# Altium project sudoku.PrjPcb
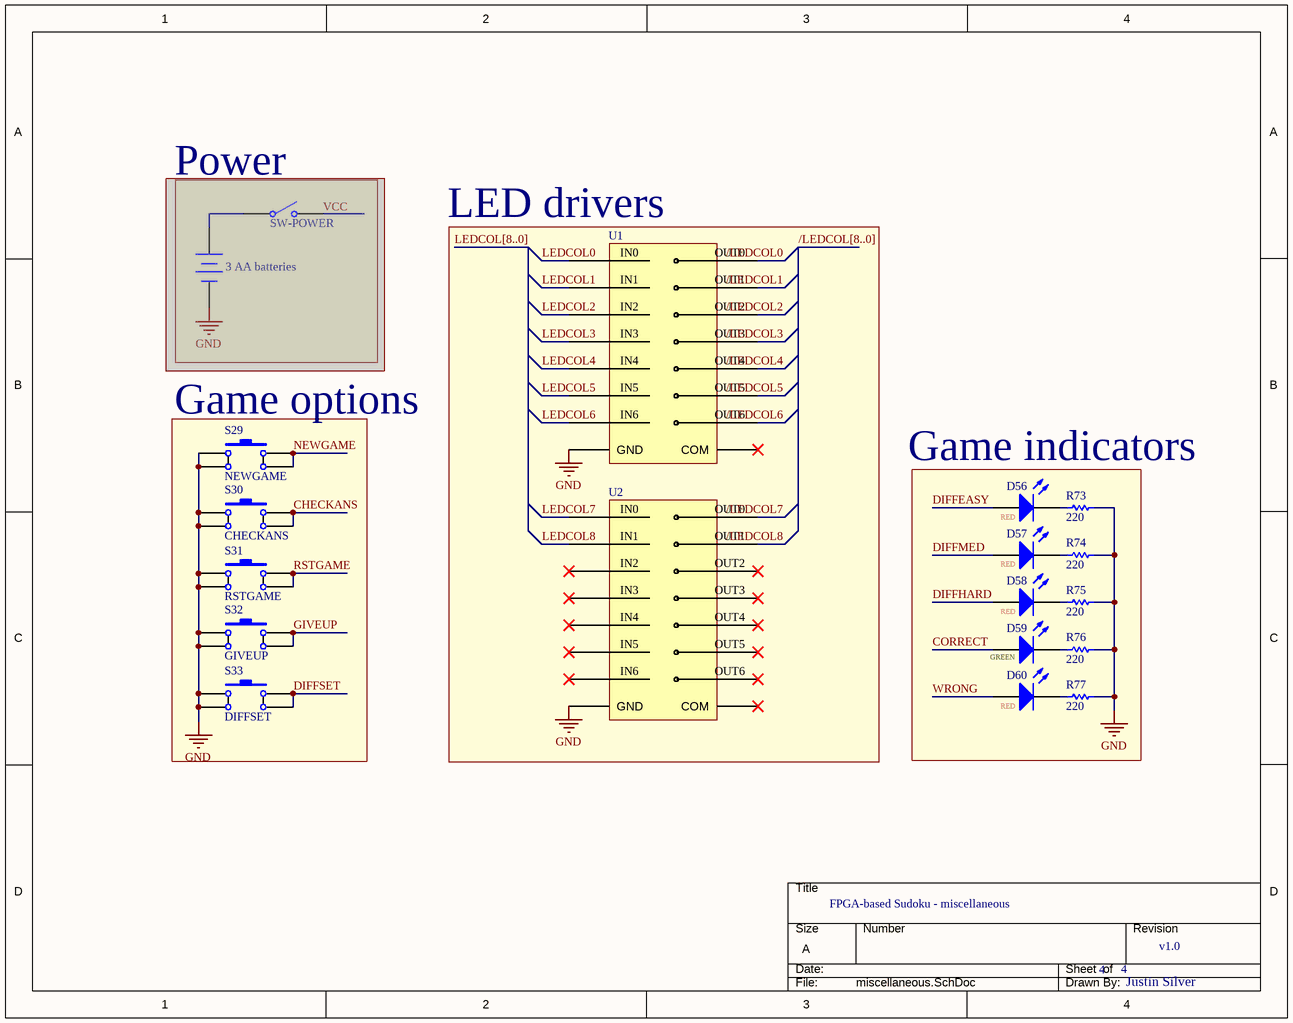
[diagram p0: miscellaneous.SchDoc]
4 sheets, 204 parts. Net scope: global (net labels, ports and power ports of the same name join across sheets).
Board file: sudoku.PcbDoc
Sheets:
  miscellaneous.SchDoc
  connectors.SchDoc
  keyboard.SchDoc
  display.SchDoc

## Sheet miscellaneous.SchDoc: FPGA-based Sudoku - miscellaneous
size A; Author: Justin Silver; DocumentNumber: 4; Revision: v1.0; SheetNumber: 4; SheetTotal: 4; ENG_APP_DATE: --/--/--; DSN_APP_DATE: --/--/--; CHK_APP_DATE: --/--/--

### Parts
BT?  3 AA batteries  [BAT-2]  (masked out: inside a compile mask, not in the netlist)
D56  RED  [RED]
D57  RED  [RED]
D58  RED  [RED]
D59  GREEN  [green]
D60  RED  [RED]
R73  value 220  [SMD-0805-RES]  (hidden comment: Res1)
R74  value 220  [SMD-0805-RES]  (hidden comment: Res1)
R75  value 220  [SMD-0805-RES]  (hidden comment: Res1)
R76  value 220  [SMD-0805-RES]  (hidden comment: Res1)
R77  value 220  [SMD-0805-RES]  (hidden comment: Res1)
S29  NEWGAME  [SW_1825910-6-4]
S30  CHECKANS  [SW_1825910-6-4]
S31  RSTGAME  [SW_1825910-6-4]
S32  GIVEUP  [SW_1825910-6-4]
S33  DIFFSET  [SW_1825910-6-4]
S?  SW-POWER  [SPST-2]  (masked out: inside a compile mask, not in the netlist)
U1  (no value)  [DIL16]
U2  (no value)  [DIL16]

### Blocks framed on the sheet
Power: BT? S?
LED drivers: U1 U2
Game options: S29-S33

### Nets
GND: R73.2 R74.2 R75.2 R76.2 R77.2 S29.3 S29.4 S30.3 S30.4 S31.3 S31.4 S32.3 S32.4 S33.3 S33.4 U1.8(GND) U2.8(GND)
/LEDCOL0: U1.16(IN0)
/LEDCOL1: U1.15(IN1)
/LEDCOL2: U1.14(IN2)
/LEDCOL3: U1.13(IN3)
/LEDCOL4: U1.12(IN4)
/LEDCOL5: U1.11(IN5)
/LEDCOL6: U1.10(IN6)
/LEDCOL7: U2.16(IN0)
/LEDCOL8: U2.15(IN1)
CHECKANS: S30.1 S30.2
CORRECT: D59.1(A)
DIFFEASY: D56.1(A)
DIFFHARD: D58.1(A)
DIFFMED: D57.1(A)
DIFFSET: S33.1 S33.2
GIVEUP: S32.1 S32.2
LEDCOL0: U1.6(IN5)
LEDCOL1: U1.5(IN4)
LEDCOL2: U1.4(IN3)
LEDCOL3: U1.3(IN2)
LEDCOL4: U1.2(IN1)
LEDCOL5: U1.1(IN0)
LEDCOL6: U1.7(IN6)
LEDCOL7: U2.1(IN0)
LEDCOL8: U2.2(IN1)
NEWGAME: S29.1 S29.2
RSTGAME: S31.1 S31.2
WRONG: D60.1(A)
NetD56_2: D56.2(K) R73.1
NetD57_2: D57.2(K) R74.1
NetD58_2: D58.2(K) R75.1
NetD59_2: D59.2(K) R76.1
NetD60_2: D60.2(K) R77.1

Not connected (* = marked no-connect by the designer): U1 9(COM)*; U2 3(IN2)* 4(IN3)* 5(IN4)* 6(IN5)* 7(IN6)* 9(COM)* 10(IN6)* 11(IN5)* 12(IN4)* 13(IN3)* 14(IN2)*

### Buses and harness runs
bus /LEDCOL[8..0]
bus LEDCOL[8..0]

### Notes on the sheet
- Game indicators
- VCC and ground can be plugged directly in to devkit headers (power pin VCC 5P0 for example) from Dupont cables and from AA battery holder.
  Or, I could use a 4.5mm 1.3mm power jack, that way i have proper diode protection for reverse polarization
- DWG. NO.
- REV.
- SHT.
- THIS DOCUMENT AND THE DATA DISCLOSED HEREIN OR HEREWITH IS THE PROPERTY OF ALTIUM LIMITED AND MAY BE FREELY DISTRIBUTED IN WHOLE. NO RIGHTS ARE RESERVED OR EXPRESS OR IMPLIED WARANTEE GIVEN.
- REVISION
- DESCRIPTION
- DATE
- APPROVED
- ENG:
- APPROVALS
- PROJECT
- DSN:
- CHK:
- REFERENCE DOCUMENTS
- PROJECT REVISION:
- TITLE
- DOCUMENT REVISION:
- DESIGN ITEM:
- BOM:
- FAB DWG:
- PCB DWG:
- ASSY DWG:
- SCALE:
- SIZE
- B
- CAGE CODE
- FILE NAME
- DWG NO.
- SHEET
- OF
- REV
- (in symbol ULN2003A) OUT0; OUT1; OUT2; OUT3; OUT4; OUT5; OUT6

### Library data of the parts
BT? = Battery: Multicell Battery; Published: 24-Mar-1999; LatestRevisionDate: 17-Jul-2002; LatestRevisionNote: Re-released for DXP Platform.; PackageReference: BAT-2; Publisher: Altium Limited; PackageDescription: Battery; 2 Leads
D56-D60 = LED1: Typical RED GaAs LED; Published: 8-Jun-2000; LatestRevisionDate: 08-Jul-2005; LatestRevisionNote: Mech Layer 1 removed.; PackageReference: LED-1; Publisher: Altium Limited; PackageDescription: LED; 2 Leads
R73-R77 = Res1: Resistor; Published: 8-Jun-2000; LatestRevisionDate: 17-Jul-2002; LatestRevisionNote: Re-released for DXP Platform.; PackageReference: AXIAL-0.3; Publisher: Altium Limited; PackageDescription: Axial Device, Thru-Hole; 2 Leads; 0.3 in Pin Spacing
S29-S33 = SW-PB: Switch; Published: 24-Mar-1999; LatestRevisionDate: 17-Jul-2002; LatestRevisionNote: Re-released for DXP Platform.; PackageReference: SPST-2; Publisher: Altium Limited; PackageDescription: Switch; 2 Leads
S? = SW-SPST: Single-Pole, Single-Throw Switch; Published: 24-Mar-1999; LatestRevisionDate: 17-Jul-2002; LatestRevisionNote: Re-released for DXP Platform.; PackageReference: SPST-2; Publisher: Altium Limited; PackageDescription: Switch; 2 Leads
U1 U2 = ULN2003A

## Sheet connectors.SchDoc: FPGA-based Sudoku - connectors
size B; Author: Justin Silver; DocumentNumber: 2; Revision: v1.0; SheetNumber: 2; SheetTotal: 4
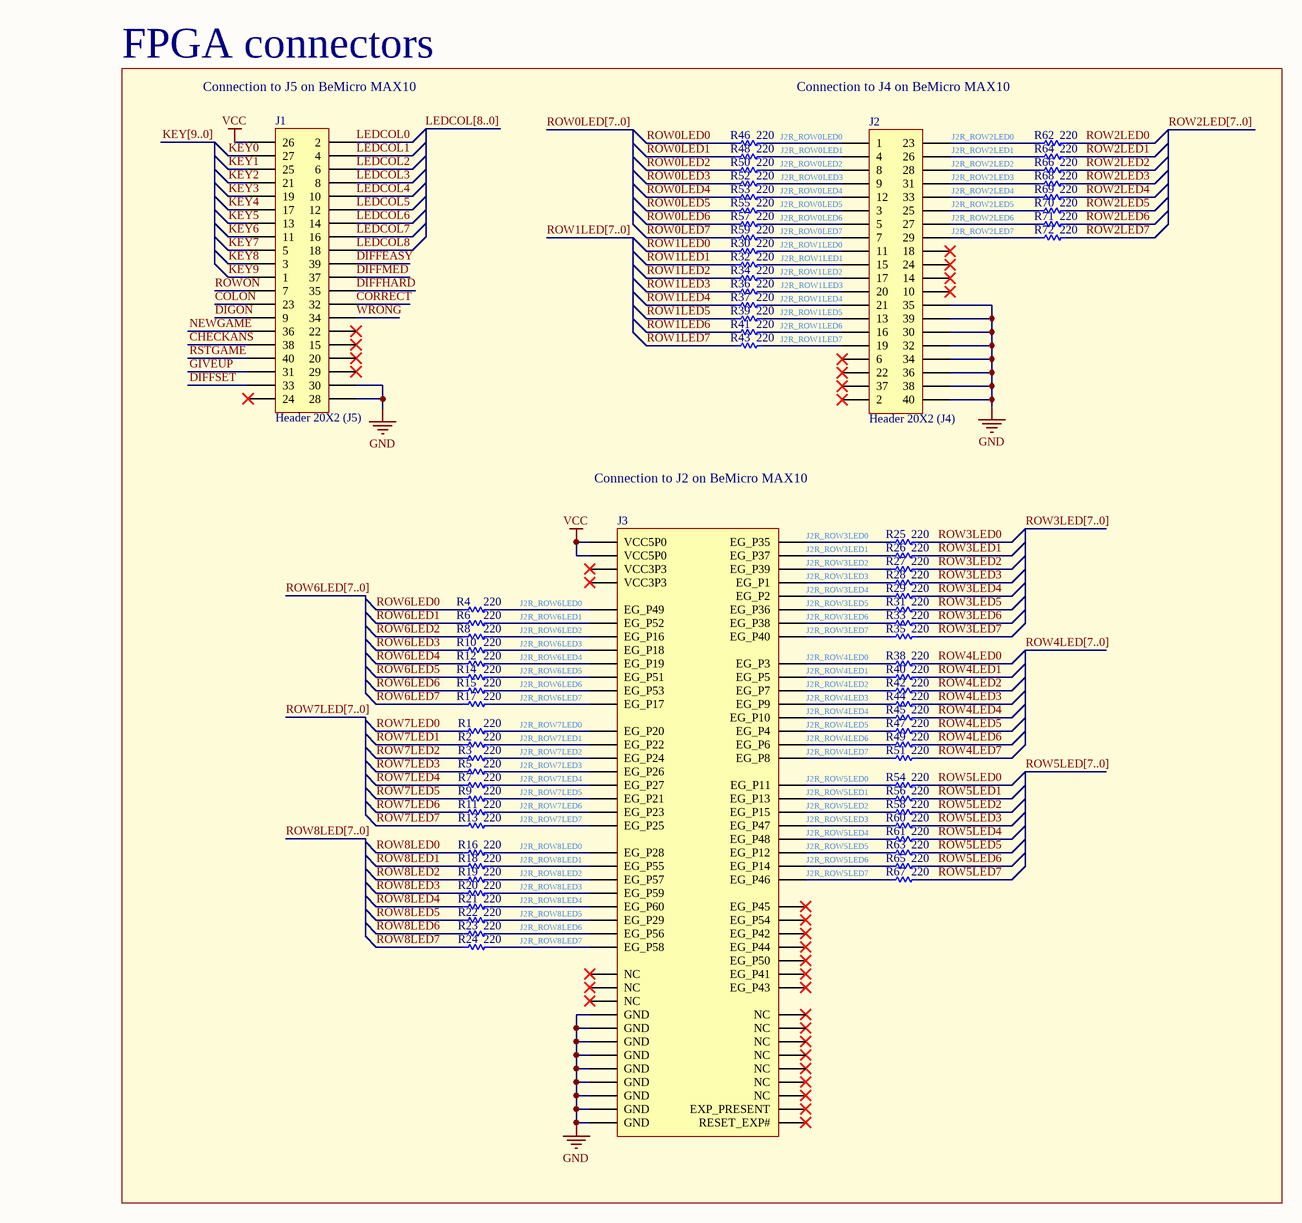
[diagram p1: connectors.SchDoc]

### Parts
J1  Header 20X2 (J5)  [2x20]
J2  Header 20X2 (J4)  [2x20]
J3  (no value)  [SAMTEC_MEC6-140-02-L-D-RA1-TR]
R1  value 220  [SMD-0805-RES]  (hidden comment: Res1)
R2  value 220  [SMD-0805-RES]  (hidden comment: Res1)
R3  value 220  [SMD-0805-RES]  (hidden comment: Res1)
R4  value 220  [SMD-0805-RES]  (hidden comment: Res1)
R5  value 220  [SMD-0805-RES]  (hidden comment: Res1)
R6  value 220  [SMD-0805-RES]  (hidden comment: Res1)
R7  value 220  [SMD-0805-RES]  (hidden comment: Res1)
R8  value 220  [SMD-0805-RES]  (hidden comment: Res1)
R9  value 220  [SMD-0805-RES]  (hidden comment: Res1)
R10  value 220  [SMD-0805-RES]  (hidden comment: Res1)
R11  value 220  [SMD-0805-RES]  (hidden comment: Res1)
R12  value 220  [SMD-0805-RES]  (hidden comment: Res1)
R13  value 220  [SMD-0805-RES]  (hidden comment: Res1)
R14  value 220  [SMD-0805-RES]  (hidden comment: Res1)
R15  value 220  [SMD-0805-RES]  (hidden comment: Res1)
R16  value 220  [SMD-0805-RES]  (hidden comment: Res1)
R17  value 220  [SMD-0805-RES]  (hidden comment: Res1)
R18  value 220  [SMD-0805-RES]  (hidden comment: Res1)
R19  value 220  [SMD-0805-RES]  (hidden comment: Res1)
R20  value 220  [SMD-0805-RES]  (hidden comment: Res1)
R21  value 220  [SMD-0805-RES]  (hidden comment: Res1)
R22  value 220  [SMD-0805-RES]  (hidden comment: Res1)
R23  value 220  [SMD-0805-RES]  (hidden comment: Res1)
R24  value 220  [SMD-0805-RES]  (hidden comment: Res1)
R25  value 220  [SMD-0805-RES]  (hidden comment: Res1)
R26  value 220  [SMD-0805-RES]  (hidden comment: Res1)
R27  value 220  [SMD-0805-RES]  (hidden comment: Res1)
R28  value 220  [SMD-0805-RES]  (hidden comment: Res1)
R29  value 220  [SMD-0805-RES]  (hidden comment: Res1)
R30  value 220  [SMD-0805-RES]  (hidden comment: Res1)
R31  value 220  [SMD-0805-RES]  (hidden comment: Res1)
R32  value 220  [SMD-0805-RES]  (hidden comment: Res1)
R33  value 220  [SMD-0805-RES]  (hidden comment: Res1)
R34  value 220  [SMD-0805-RES]  (hidden comment: Res1)
R35  value 220  [SMD-0805-RES]  (hidden comment: Res1)
R36  value 220  [SMD-0805-RES]  (hidden comment: Res1)
R37  value 220  [SMD-0805-RES]  (hidden comment: Res1)
R38  value 220  [SMD-0805-RES]  (hidden comment: Res1)
R39  value 220  [SMD-0805-RES]  (hidden comment: Res1)
R40  value 220  [SMD-0805-RES]  (hidden comment: Res1)
R41  value 220  [SMD-0805-RES]  (hidden comment: Res1)
R42  value 220  [SMD-0805-RES]  (hidden comment: Res1)
R43  value 220  [SMD-0805-RES]  (hidden comment: Res1)
R44  value 220  [SMD-0805-RES]  (hidden comment: Res1)
R45  value 220  [SMD-0805-RES]  (hidden comment: Res1)
R46  value 220  [SMD-0805-RES]  (hidden comment: Res1)
R47  value 220  [SMD-0805-RES]  (hidden comment: Res1)
R48  value 220  [SMD-0805-RES]  (hidden comment: Res1)
R49  value 220  [SMD-0805-RES]  (hidden comment: Res1)
R50  value 220  [SMD-0805-RES]  (hidden comment: Res1)
R51  value 220  [SMD-0805-RES]  (hidden comment: Res1)
R52  value 220  [SMD-0805-RES]  (hidden comment: Res1)
R53  value 220  [SMD-0805-RES]  (hidden comment: Res1)
R54  value 220  [SMD-0805-RES]  (hidden comment: Res1)
R55  value 220  [SMD-0805-RES]  (hidden comment: Res1)
R56  value 220  [SMD-0805-RES]  (hidden comment: Res1)
R57  value 220  [SMD-0805-RES]  (hidden comment: Res1)
R58  value 220  [SMD-0805-RES]  (hidden comment: Res1)
R59  value 220  [SMD-0805-RES]  (hidden comment: Res1)
R60  value 220  [SMD-0805-RES]  (hidden comment: Res1)
R61  value 220  [SMD-0805-RES]  (hidden comment: Res1)
R62  value 220  [SMD-0805-RES]  (hidden comment: Res1)
R63  value 220  [SMD-0805-RES]  (hidden comment: Res1)
R64  value 220  [SMD-0805-RES]  (hidden comment: Res1)
R65  value 220  [SMD-0805-RES]  (hidden comment: Res1)
R66  value 220  [SMD-0805-RES]  (hidden comment: Res1)
R67  value 220  [SMD-0805-RES]  (hidden comment: Res1)
R68  value 220  [SMD-0805-RES]  (hidden comment: Res1)
R69  value 220  [SMD-0805-RES]  (hidden comment: Res1)
R70  value 220  [SMD-0805-RES]  (hidden comment: Res1)
R71  value 220  [SMD-0805-RES]  (hidden comment: Res1)
R72  value 220  [SMD-0805-RES]  (hidden comment: Res1)

### Nets
GND: J1.28 J1.30 J2.30 J2.32 J2.34 J2.35 J2.36 J2.38 J2.39 J2.40 J3.10(GND) J3.21(GND) J3.22(GND) J3.32(GND) J3.33(GND) J3.44(GND) J3.53(GND) J3.54(GND) J3.76(GND)
VCC: J1.26 J3.79(VCC5P0) J3.80(VCC5P0)
CHECKANS: J1.38
COLON: J1.23
CORRECT: J1.32
DIFFEASY: J1.39
DIFFHARD: J1.35
DIFFMED: J1.37
DIFFSET: J1.33
DIGON: J1.9
GIVEUP: J1.31
J2R_ROW0LED0: J2.1 R46.2
J2R_ROW0LED1: J2.4 R48.2
J2R_ROW0LED2: J2.8 R50.2
J2R_ROW0LED3: J2.9 R52.2
J2R_ROW0LED4: J2.12 R53.2
J2R_ROW0LED5: J2.3 R55.2
J2R_ROW0LED6: J2.5 R57.2
J2R_ROW0LED7: J2.7 R59.2
J2R_ROW1LED0: J2.11 R30.2
J2R_ROW1LED1: J2.15 R32.2
J2R_ROW1LED2: J2.17 R34.2
J2R_ROW1LED3: J2.20 R36.2
J2R_ROW1LED4: J2.21 R37.2
J2R_ROW1LED5: J2.13 R39.2
J2R_ROW1LED6: J2.16 R41.2
J2R_ROW1LED7: J2.19 R43.2
J2R_ROW2LED0: J2.23 R62.1
J2R_ROW2LED1: J2.26 R64.1
J2R_ROW2LED2: J2.28 R66.1
J2R_ROW2LED3: J2.31 R68.1
J2R_ROW2LED4: J2.33 R69.1
J2R_ROW2LED5: J2.25 R70.1
J2R_ROW2LED6: J2.27 R71.1
J2R_ROW2LED7: J2.29 R72.1
J2R_ROW3LED0: J3.06(EG_P35) R25.1
J2R_ROW3LED1: J3.12(EG_P37) R26.1
J2R_ROW3LED2: J3.16(EG_P39) R27.1
J2R_ROW3LED3: J3.05(EG_P1) R28.1
J2R_ROW3LED4: J3.07(EG_P2) R29.1
J2R_ROW3LED5: J3.08(EG_P36) R31.1
J2R_ROW3LED6: J3.14(EG_P38) R33.1
J2R_ROW3LED7: J3.18(EG_P40) R35.1
J2R_ROW4LED0: J3.09(EG_P3) R38.1
J2R_ROW4LED1: J3.13(EG_P5) R40.1
J2R_ROW4LED2: J3.17(EG_P7) R42.1
J2R_ROW4LED3: J3.23(EG_P9) R44.1
J2R_ROW4LED4: J3.25(EG_P10) R45.1
J2R_ROW4LED5: J3.11(EG_P4) R47.1
J2R_ROW4LED6: J3.15(EG_P6) R49.1
J2R_ROW4LED7: J3.19(EG_P8) R51.1
J2R_ROW5LED0: J3.27(EG_P11) R54.1
J2R_ROW5LED1: J3.31(EG_P13) R56.1
J2R_ROW5LED2: J3.37(EG_P15) R58.1
J2R_ROW5LED3: J3.36(EG_P47) R60.1
J2R_ROW5LED4: J3.38(EG_P48) R61.1
J2R_ROW5LED5: J3.29(EG_P12) R63.1
J2R_ROW5LED6: J3.35(EG_P14) R65.1
J2R_ROW5LED7: J3.34(EG_P46) R67.1
J2R_ROW6LED0: J3.40(EG_P49) R4.2
J2R_ROW6LED1: J3.48(EG_P52) R6.2
J2R_ROW6LED2: J3.39(EG_P16) R8.2
J2R_ROW6LED3: J3.43(EG_P18) R10.2
J2R_ROW6LED4: J3.45(EG_P19) R12.2
J2R_ROW6LED5: J3.46(EG_P51) R14.2
J2R_ROW6LED6: J3.50(EG_P53) R15.2
J2R_ROW6LED7: J3.41(EG_P17) R17.2
J2R_ROW7LED0: J3.47(EG_P20) R1.2
J2R_ROW7LED1: J3.51(EG_P22) R2.2
J2R_ROW7LED2: J3.57(EG_P24) R3.2
J2R_ROW7LED3: J3.61(EG_P26) R5.2
J2R_ROW7LED4: J3.63(EG_P27) R7.2
J2R_ROW7LED5: J3.49(EG_P21) R9.2
J2R_ROW7LED6: J3.55(EG_P23) R11.2
J2R_ROW7LED7: J3.59(EG_P25) R13.2
J2R_ROW8LED0: J3.65(EG_P28) R16.2
J2R_ROW8LED1: J3.56(EG_P55) R18.2
J2R_ROW8LED2: J3.60(EG_P57) R19.2
J2R_ROW8LED3: J3.64(EG_P59) R20.2
J2R_ROW8LED4: J3.66(EG_P60) R21.2
J2R_ROW8LED5: J3.67(EG_P29) R22.2
J2R_ROW8LED6: J3.58(EG_P56) R23.2
J2R_ROW8LED7: J3.62(EG_P58) R24.2
KEY0: J1.27
KEY1: J1.25
KEY2: J1.21
KEY3: J1.19
KEY4: J1.17
KEY5: J1.13
KEY6: J1.11
KEY7: J1.5
KEY8: J1.3
KEY9: J1.1
LEDCOL0: J1.2
LEDCOL1: J1.4
LEDCOL2: J1.6
LEDCOL3: J1.8
LEDCOL4: J1.10
LEDCOL5: J1.12
LEDCOL6: J1.14
LEDCOL7: J1.16
LEDCOL8: J1.18
NEWGAME: J1.36
ROW0LED0: R46.1
ROW0LED1: R48.1
ROW0LED2: R50.1
ROW0LED3: R52.1
ROW0LED4: R53.1
ROW0LED5: R55.1
ROW0LED6: R57.1
ROW0LED7: R59.1
ROW1LED0: R30.1
ROW1LED1: R32.1
ROW1LED2: R34.1
ROW1LED3: R36.1
ROW1LED4: R37.1
ROW1LED5: R39.1
ROW1LED6: R41.1
ROW1LED7: R43.1
ROW2LED0: R62.2
ROW2LED1: R64.2
ROW2LED2: R66.2
ROW2LED3: R68.2
ROW2LED4: R69.2
ROW2LED5: R70.2
ROW2LED6: R71.2
ROW2LED7: R72.2
ROW3LED0: R25.2
ROW3LED1: R26.2
ROW3LED2: R27.2
ROW3LED3: R28.2
ROW3LED4: R29.2
ROW3LED5: R31.2
ROW3LED6: R33.2
ROW3LED7: R35.2
ROW4LED0: R38.2
ROW4LED1: R40.2
ROW4LED2: R42.2
ROW4LED3: R44.2
ROW4LED4: R45.2
ROW4LED5: R47.2
ROW4LED6: R49.2
ROW4LED7: R51.2
ROW5LED0: R54.2
ROW5LED1: R56.2
ROW5LED2: R58.2
ROW5LED3: R60.2
ROW5LED4: R61.2
ROW5LED5: R63.2
ROW5LED6: R65.2
ROW5LED7: R67.2
ROW6LED0: R4.1
ROW6LED1: R6.1
ROW6LED2: R8.1
ROW6LED3: R10.1
ROW6LED4: R12.1
ROW6LED5: R14.1
ROW6LED6: R15.1
ROW6LED7: R17.1
ROW7LED0: R1.1
ROW7LED1: R2.1
ROW7LED2: R3.1
ROW7LED3: R5.1
ROW7LED4: R7.1
ROW7LED5: R9.1
ROW7LED6: R11.1
ROW7LED7: R13.1
ROW8LED0: R16.1
ROW8LED1: R18.1
ROW8LED2: R19.1
ROW8LED3: R20.1
ROW8LED4: R21.1
ROW8LED5: R22.1
ROW8LED6: R23.1
ROW8LED7: R24.1
ROWON: J1.7
RSTGAME: J1.40
WRONG: J1.34

Not connected (* = marked no-connect by the designer): J1 15* 20* 22* 24* 29*; J2 2* 6* 10* 14* 18* 22* 24* 37*; J3 01(VCC3P3)* 02(VCC3P3)* 03(RESET_EXP#)* 04(NC)* 20(EG_P41)* 24(EG_P42)* 26(EG_P43)* 28(EG_P44)* 30(EG_P45)* 42(EG_P50)* 52(EG_P54)* 68(NC)* 69(NC)* 70(NC)* 71(NC)* 72(NC)* 73(NC)* 74(NC)* 75(NC)* 77(NC)* 78(EXP_PRESENT)*

### Buses and harness runs
bus KEY[9..0]
bus LEDCOL[8..0]
bus ROW0LED[7..0]
bus ROW1LED[7..0]
bus ROW2LED[7..0]
bus ROW3LED[7..0]
bus ROW4LED[7..0]
bus ROW5LED[7..0]
bus ROW6LED[7..0]
bus ROW7LED[7..0]
bus ROW8LED[7..0]

### Notes on the sheet
- FPGA connectors
- (near J1) Connection to J5 on BeMicro MAX10
- Connection to J4 on BeMicro MAX10
- (near J1) With the J4 FPGA header, we can only connect 24 signals. We are free to pin swap on the PCB header, and then in Quartus pin planner we can choose where to connect the signals.
  With the J5 connector, we can only connect 36 signals. We are free to pin swap on the PCB side.
  We are allowed to completely pin swap the jumpers on the PCB side, since we are manually connecting the jumpers from the FPGA to PCB
- Connection to J2 on BeMicro MAX10
- Pin information
  ***VCC and GND pin not included in count
  Dev kit pins needed: 102 (3 for difficulty, 72 for segments, 9 for columns, 10 for keyboard matrix, 3 for ON signals, 5 for game options
  EDGE CONNECTOR (MEC6-140_CARD =
  MEC6-140-02-L-D-RA1-TR ): 60 GPIO (EG_PX)
  PIN_HEADER_2x20 (J5): 36
  PIN_HEADER_2x20 (J4): 26
  Idea: Header J5 takes care of all the signals that are not for the LED segment lines
  Edge connector and J4 take care of all the LED segment lines
  So I would have a 30 pin header (for J5 non LED seg pins), then the max connector for 60 pins (LED seg edge) then a 12 pin header (rest of LED seg pins)

### Library data of the parts
J1 J2 = Header 20X2: Header, 20-Pin, Dual row; LatestRevisionDate: 17-Jul-2002; LatestRevisionNote: Re-released for DXP Platform.; Publisher: Altium Limited
J3 = MEC6-140-02-L-D-RA1-TR: Edge connector; MF: Samtec; Price: None; Availability: Unavailable; Package: None; Value: *; MP: MEC6-140-02-L-D-RA1-TR
R1-R72 = Res1: Resistor; Published: 8-Jun-2000; LatestRevisionDate: 17-Jul-2002; LatestRevisionNote: Re-released for DXP Platform.; PackageReference: AXIAL-0.3; Publisher: Altium Limited; PackageDescription: Axial Device, Thru-Hole; 2 Leads; 0.3 in Pin Spacing

## Sheet keyboard.SchDoc: FPGA-based Sudoku - keyboard
size B; Author: Justin Silver; DocumentNumber: 1; Revision: v1.0; SheetNumber: 1; SheetTotal: 4
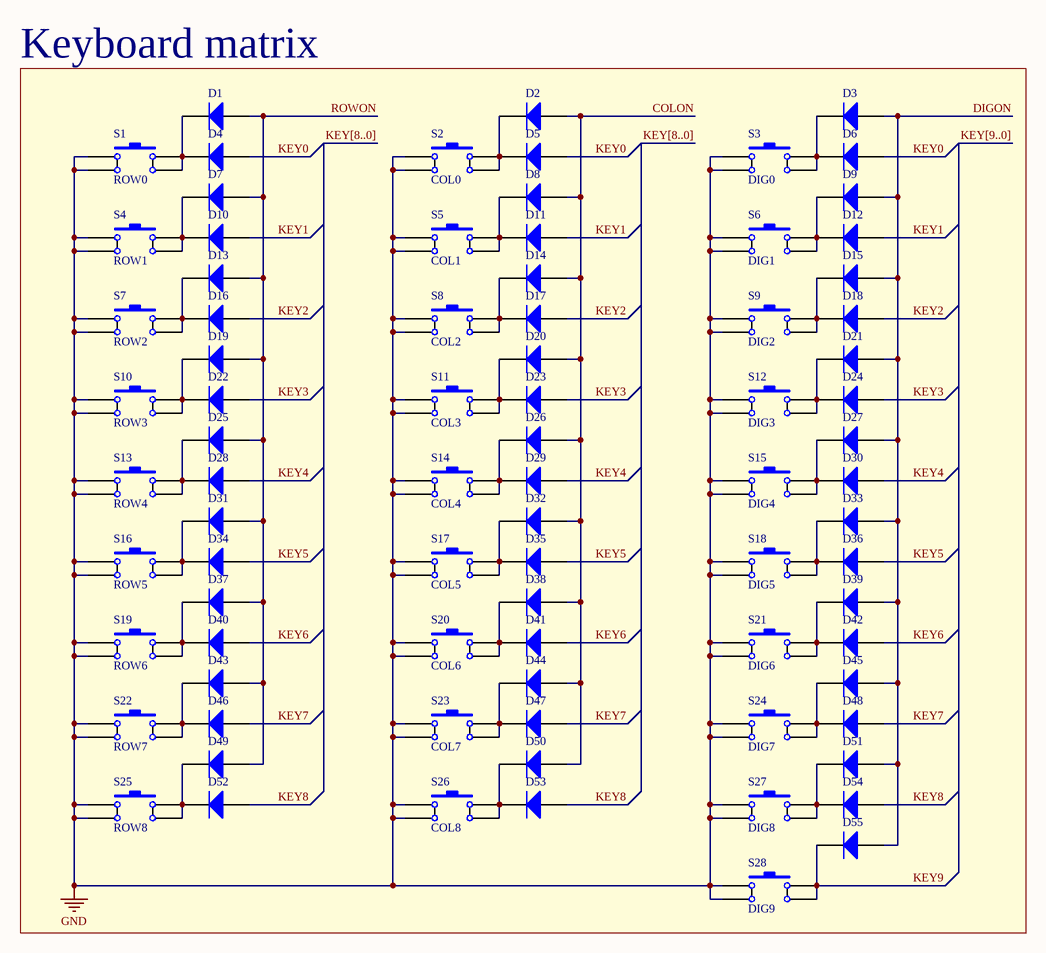
[diagram p2: keyboard.SchDoc]

### Parts
D1  Diode 1N4007  [DIODE_SMC]  (value not drawn)
D2  Diode 1N4007  [DIODE_SMC]  (value not drawn)
D3  Diode 1N4007  [DIODE_SMC]  (value not drawn)
D4  Diode 1N4007  [DIODE_SMC]  (value not drawn)
D5  Diode 1N4007  [DIODE_SMC]  (value not drawn)
D6  Diode 1N4007  [DIODE_SMC]  (value not drawn)
D7  Diode 1N4007  [DIODE_SMC]  (value not drawn)
D8  Diode 1N4007  [DIODE_SMC]  (value not drawn)
D9  Diode 1N4007  [DIODE_SMC]  (value not drawn)
D10  Diode 1N4007  [DIODE_SMC]  (value not drawn)
D11  Diode 1N4007  [DIODE_SMC]  (value not drawn)
D12  Diode 1N4007  [DIODE_SMC]  (value not drawn)
D13  Diode 1N4007  [DIODE_SMC]  (value not drawn)
D14  Diode 1N4007  [DIODE_SMC]  (value not drawn)
D15  Diode 1N4007  [DIODE_SMC]  (value not drawn)
D16  Diode 1N4007  [DIODE_SMC]  (value not drawn)
D17  Diode 1N4007  [DIODE_SMC]  (value not drawn)
D18  Diode 1N4007  [DIODE_SMC]  (value not drawn)
D19  Diode 1N4007  [DIODE_SMC]  (value not drawn)
D20  Diode 1N4007  [DIODE_SMC]  (value not drawn)
D21  Diode 1N4007  [DIODE_SMC]  (value not drawn)
D22  Diode 1N4007  [DIODE_SMC]  (value not drawn)
D23  Diode 1N4007  [DIODE_SMC]  (value not drawn)
D24  Diode 1N4007  [DIODE_SMC]  (value not drawn)
D25  Diode 1N4007  [DIODE_SMC]  (value not drawn)
D26  Diode 1N4007  [DIODE_SMC]  (value not drawn)
D27  Diode 1N4007  [DIODE_SMC]  (value not drawn)
D28  Diode 1N4007  [DIODE_SMC]  (value not drawn)
D29  Diode 1N4007  [DIODE_SMC]  (value not drawn)
D30  Diode 1N4007  [DIODE_SMC]  (value not drawn)
D31  Diode 1N4007  [DIODE_SMC]  (value not drawn)
D32  Diode 1N4007  [DIODE_SMC]  (value not drawn)
D33  Diode 1N4007  [DIODE_SMC]  (value not drawn)
D34  Diode 1N4007  [DIODE_SMC]  (value not drawn)
D35  Diode 1N4007  [DIODE_SMC]  (value not drawn)
D36  Diode 1N4007  [DIODE_SMC]  (value not drawn)
D37  Diode 1N4007  [DIODE_SMC]  (value not drawn)
D38  Diode 1N4007  [DIODE_SMC]  (value not drawn)
D39  Diode 1N4007  [DIODE_SMC]  (value not drawn)
D40  Diode 1N4007  [DIODE_SMC]  (value not drawn)
D41  Diode 1N4007  [DIODE_SMC]  (value not drawn)
D42  Diode 1N4007  [DIODE_SMC]  (value not drawn)
D43  Diode 1N4007  [DIODE_SMC]  (value not drawn)
D44  Diode 1N4007  [DIODE_SMC]  (value not drawn)
D45  Diode 1N4007  [DIODE_SMC]  (value not drawn)
D46  Diode 1N4007  [DIODE_SMC]  (value not drawn)
D47  Diode 1N4007  [DIODE_SMC]  (value not drawn)
D48  Diode 1N4007  [DIODE_SMC]  (value not drawn)
D49  Diode 1N4007  [DIODE_SMC]  (value not drawn)
D50  Diode 1N4007  [DIODE_SMC]  (value not drawn)
D51  Diode 1N4007  [DIODE_SMC]  (value not drawn)
D52  Diode 1N4007  [DIODE_SMC]  (value not drawn)
D53  Diode 1N4007  [DIODE_SMC]  (value not drawn)
D54  Diode 1N4007  [DIODE_SMC]  (value not drawn)
D55  Diode 1N4007  [DIODE_SMC]  (value not drawn)
S1  ROW0  [SW_1825910-6-4]
S2  COL0  [SW_1825910-6-4]
S3  DIG0  [SW_1825910-6-4]
S4  ROW1  [SW_1825910-6-4]
S5  COL1  [SW_1825910-6-4]
S6  DIG1  [SW_1825910-6-4]
S7  ROW2  [SW_1825910-6-4]
S8  COL2  [SW_1825910-6-4]
S9  DIG2  [SW_1825910-6-4]
S10  ROW3  [SW_1825910-6-4]
S11  COL3  [SW_1825910-6-4]
S12  DIG3  [SW_1825910-6-4]
S13  ROW4  [SW_1825910-6-4]
S14  COL4  [SW_1825910-6-4]
S15  DIG4  [SW_1825910-6-4]
S16  ROW5  [SW_1825910-6-4]
S17  COL5  [SW_1825910-6-4]
S18  DIG5  [SW_1825910-6-4]
S19  ROW6  [SW_1825910-6-4]
S20  COL6  [SW_1825910-6-4]
S21  DIG6  [SW_1825910-6-4]
S22  ROW7  [SW_1825910-6-4]
S23  COL7  [SW_1825910-6-4]
S24  DIG7  [SW_1825910-6-4]
S25  ROW8  [SW_1825910-6-4]
S26  COL8  [SW_1825910-6-4]
S27  DIG8  [SW_1825910-6-4]
S28  DIG9  [SW_1825910-6-4]

### Blocks framed on the sheet
Keyboard matrix: D1-D55 S1-S28

### Nets
GND: S1.3 S1.4 S2.3 S2.4 S3.3 S3.4 S4.3 S4.4 S5.3 S5.4 S6.3 S6.4 S7.3 S7.4 S8.3 S8.4 S9.3 S9.4 S10.3 S10.4 S11.3 S11.4 S12.3 S12.4 S13.3 S13.4 S14.3 S14.4 S15.3 S15.4 S16.3 S16.4 S17.3 S17.4 S18.3 S18.4 S19.3 S19.4 S20.3 S20.4 S21.3 S21.4 S22.3 S22.4 S23.3 S23.4 S24.3 S24.4 S25.3 S25.4 S26.3 S26.4 S27.3 S27.4 S28.3 S28.4
COLON: D2.1(A) D8.1(A) D14.1(A) D20.1(A) D26.1(A) D32.1(A) D38.1(A) D44.1(A) D50.1(A)
DIGON: D3.1(A) D9.1(A) D15.1(A) D21.1(A) D27.1(A) D33.1(A) D39.1(A) D45.1(A) D51.1(A) D55.1(A)
KEY0: D4.1(A) D5.1(A) D6.1(A)
KEY1: D10.1(A) D11.1(A) D12.1(A)
KEY2: D16.1(A) D17.1(A) D18.1(A)
KEY3: D22.1(A) D23.1(A) D24.1(A)
KEY4: D28.1(A) D29.1(A) D30.1(A)
KEY5: D34.1(A) D35.1(A) D36.1(A)
KEY6: D40.1(A) D41.1(A) D42.1(A)
KEY7: D46.1(A) D47.1(A) D48.1(A)
KEY8: D52.1(A) D53.1(A) D54.1(A)
KEY9: D55.2(K) S28.1 S28.2
ROWON: D1.1(A) D7.1(A) D13.1(A) D19.1(A) D25.1(A) D31.1(A) D37.1(A) D43.1(A) D49.1(A)
NetD1_2: D1.2(K) D4.2(K) S1.1 S1.2
NetD2_2: D2.2(K) D5.2(K) S2.1 S2.2
NetD3_2: D3.2(K) D6.2(K) S3.1 S3.2
NetD7_2: D7.2(K) D10.2(K) S4.1 S4.2
NetD8_2: D8.2(K) D11.2(K) S5.1 S5.2
NetD9_2: D9.2(K) D12.2(K) S6.1 S6.2
NetD13_2: D13.2(K) D16.2(K) S7.1 S7.2
NetD14_2: D14.2(K) D17.2(K) S8.1 S8.2
NetD15_2: D15.2(K) D18.2(K) S9.1 S9.2
NetD19_2: D19.2(K) D22.2(K) S10.1 S10.2
NetD20_2: D20.2(K) D23.2(K) S11.1 S11.2
NetD21_2: D21.2(K) D24.2(K) S12.1 S12.2
NetD25_2: D25.2(K) D28.2(K) S13.1 S13.2
NetD26_2: D26.2(K) D29.2(K) S14.1 S14.2
NetD27_2: D27.2(K) D30.2(K) S15.1 S15.2
NetD31_2: D31.2(K) D34.2(K) S16.1 S16.2
NetD32_2: D32.2(K) D35.2(K) S17.1 S17.2
NetD33_2: D33.2(K) D36.2(K) S18.1 S18.2
NetD37_2: D37.2(K) D40.2(K) S19.1 S19.2
NetD38_2: D38.2(K) D41.2(K) S20.1 S20.2
NetD39_2: D39.2(K) D42.2(K) S21.1 S21.2
NetD43_2: D43.2(K) D46.2(K) S22.1 S22.2
NetD44_2: D44.2(K) D47.2(K) S23.1 S23.2
NetD45_2: D45.2(K) D48.2(K) S24.1 S24.2
NetD49_2: D49.2(K) D52.2(K) S25.1 S25.2
NetD50_2: D50.2(K) D53.2(K) S26.1 S26.2
NetD51_2: D51.2(K) D54.2(K) S27.1 S27.2

### Buses and harness runs
bus KEY[8..0]
bus KEY[9..0]

### Library data of the parts
D1-D55 = Diode 1N4007: 1 Amp General Purpose Rectifier; Published: 8-Jun-2000; LatestRevisionDate: 17-Jul-2002; LatestRevisionNote: Re-released for DXP Platform.; DatasheetVersion: 1998; PackageVersion: Aug-1999; PackageReference: DO-41; Publisher: Altium Limited; PackageDescription: Diode, Axial; Body 5.2 x 2.7 mm (LxDia. max), Lead Dia. 0.86 mm (max); Code_JEDEC: DO-204-AL; ComponentLink1Description: Manufacturer Link; ComponentLink1URL: http://www.fairchildsemi.com/; ComponentLink2Description: Datasheet; ComponentLink2URL: http://www.fairchildsemi.com/ds/1N%2F1N4001.pdf
S1-S28 = SW-PB: Switch; Published: 24-Mar-1999; LatestRevisionDate: 17-Jul-2002; LatestRevisionNote: Re-released for DXP Platform.; PackageReference: SPST-2; Publisher: Altium Limited; PackageDescription: Switch; 2 Leads

## Sheet display.SchDoc: FPGA-based Sudoku - display
size C; Author: Justin Silver; DocumentNumber: 3; Revision: v1.0; SheetNumber: 3; SheetTotal: 4
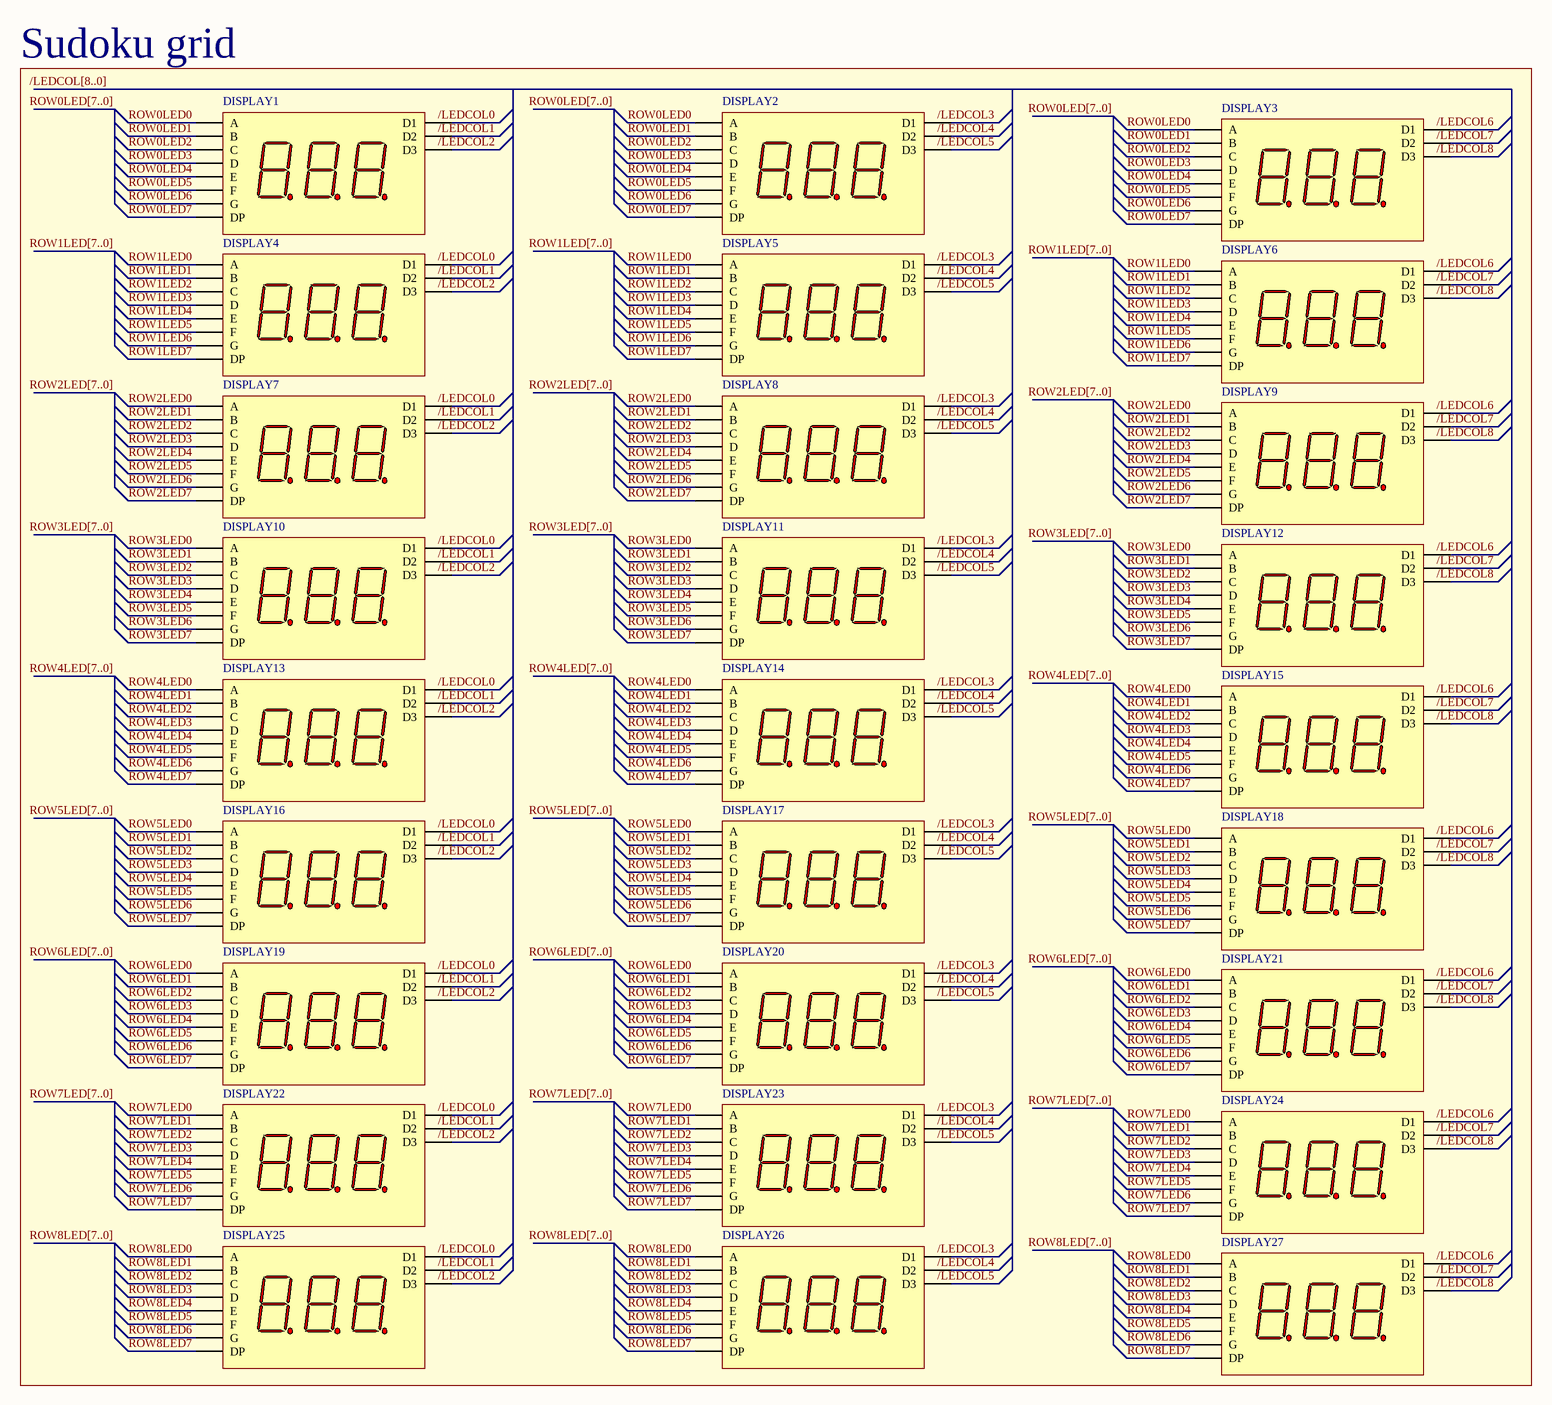
[diagram p3: display.SchDoc]

### Parts
DISPLAY1  (no value)  [3DIGITDISPLAY]
DISPLAY2  (no value)  [3DIGITDISPLAY]
DISPLAY3  (no value)  [3DIGITDISPLAY]
DISPLAY4  (no value)  [3DIGITDISPLAY]
DISPLAY5  (no value)  [3DIGITDISPLAY]
DISPLAY6  (no value)  [3DIGITDISPLAY]
DISPLAY7  (no value)  [3DIGITDISPLAY]
DISPLAY8  (no value)  [3DIGITDISPLAY]
DISPLAY9  (no value)  [3DIGITDISPLAY]
DISPLAY10  (no value)  [3DIGITDISPLAY]
DISPLAY11  (no value)  [3DIGITDISPLAY]
DISPLAY12  (no value)  [3DIGITDISPLAY]
DISPLAY13  (no value)  [3DIGITDISPLAY]
DISPLAY14  (no value)  [3DIGITDISPLAY]
DISPLAY15  (no value)  [3DIGITDISPLAY]
DISPLAY16  (no value)  [3DIGITDISPLAY]
DISPLAY17  (no value)  [3DIGITDISPLAY]
DISPLAY18  (no value)  [3DIGITDISPLAY]
DISPLAY19  (no value)  [3DIGITDISPLAY]
DISPLAY20  (no value)  [3DIGITDISPLAY]
DISPLAY21  (no value)  [3DIGITDISPLAY]
DISPLAY22  (no value)  [3DIGITDISPLAY]
DISPLAY23  (no value)  [3DIGITDISPLAY]
DISPLAY24  (no value)  [3DIGITDISPLAY]
DISPLAY25  (no value)  [3DIGITDISPLAY]
DISPLAY26  (no value)  [3DIGITDISPLAY]
DISPLAY27  (no value)  [3DIGITDISPLAY]

### Blocks framed on the sheet
Sudoku grid: DISPLAY1-DISPLAY27

### Nets
/LEDCOL0: DISPLAY1.12(D1) DISPLAY4.12(D1) DISPLAY7.12(D1) DISPLAY10.12(D1) DISPLAY13.12(D1) DISPLAY16.12(D1) DISPLAY19.12(D1) DISPLAY22.12(D1) DISPLAY25.12(D1)
/LEDCOL1: DISPLAY1.9(D2) DISPLAY4.9(D2) DISPLAY7.9(D2) DISPLAY10.9(D2) DISPLAY13.9(D2) DISPLAY16.9(D2) DISPLAY19.9(D2) DISPLAY22.9(D2) DISPLAY25.9(D2)
/LEDCOL2: DISPLAY1.8(D3) DISPLAY4.8(D3) DISPLAY7.8(D3) DISPLAY10.8(D3) DISPLAY13.8(D3) DISPLAY16.8(D3) DISPLAY19.8(D3) DISPLAY22.8(D3) DISPLAY25.8(D3)
/LEDCOL3: DISPLAY2.12(D1) DISPLAY5.12(D1) DISPLAY8.12(D1) DISPLAY11.12(D1) DISPLAY14.12(D1) DISPLAY17.12(D1) DISPLAY20.12(D1) DISPLAY23.12(D1) DISPLAY26.12(D1)
/LEDCOL4: DISPLAY2.9(D2) DISPLAY5.9(D2) DISPLAY8.9(D2) DISPLAY11.9(D2) DISPLAY14.9(D2) DISPLAY17.9(D2) DISPLAY20.9(D2) DISPLAY23.9(D2) DISPLAY26.9(D2)
/LEDCOL5: DISPLAY2.8(D3) DISPLAY5.8(D3) DISPLAY8.8(D3) DISPLAY11.8(D3) DISPLAY14.8(D3) DISPLAY17.8(D3) DISPLAY20.8(D3) DISPLAY23.8(D3) DISPLAY26.8(D3)
/LEDCOL6: DISPLAY3.12(D1) DISPLAY6.12(D1) DISPLAY9.12(D1) DISPLAY12.12(D1) DISPLAY15.12(D1) DISPLAY18.12(D1) DISPLAY21.12(D1) DISPLAY24.12(D1) DISPLAY27.12(D1)
/LEDCOL7: DISPLAY3.9(D2) DISPLAY6.9(D2) DISPLAY9.9(D2) DISPLAY12.9(D2) DISPLAY15.9(D2) DISPLAY18.9(D2) DISPLAY21.9(D2) DISPLAY24.9(D2) DISPLAY27.9(D2)
/LEDCOL8: DISPLAY3.8(D3) DISPLAY6.8(D3) DISPLAY9.8(D3) DISPLAY12.8(D3) DISPLAY15.8(D3) DISPLAY18.8(D3) DISPLAY21.8(D3) DISPLAY24.8(D3) DISPLAY27.8(D3)
ROW0LED0: DISPLAY1.11(A) DISPLAY2.11(A) DISPLAY3.11(A)
ROW0LED1: DISPLAY1.7(B) DISPLAY2.7(B) DISPLAY3.7(B)
ROW0LED2: DISPLAY1.4(C) DISPLAY2.4(C) DISPLAY3.4(C)
ROW0LED3: DISPLAY1.2(D) DISPLAY2.2(D) DISPLAY3.2(D)
ROW0LED4: DISPLAY1.1(E) DISPLAY2.1(E) DISPLAY3.1(E)
ROW0LED5: DISPLAY1.10(F) DISPLAY2.10(F) DISPLAY3.10(F)
ROW0LED6: DISPLAY1.5(G) DISPLAY2.5(G) DISPLAY3.5(G)
ROW0LED7: DISPLAY1.3(DP) DISPLAY2.3(DP) DISPLAY3.3(DP)
ROW1LED0: DISPLAY4.11(A) DISPLAY5.11(A) DISPLAY6.11(A)
ROW1LED1: DISPLAY4.7(B) DISPLAY5.7(B) DISPLAY6.7(B)
ROW1LED2: DISPLAY4.4(C) DISPLAY5.4(C) DISPLAY6.4(C)
ROW1LED3: DISPLAY4.2(D) DISPLAY5.2(D) DISPLAY6.2(D)
ROW1LED4: DISPLAY4.1(E) DISPLAY5.1(E) DISPLAY6.1(E)
ROW1LED5: DISPLAY4.10(F) DISPLAY5.10(F) DISPLAY6.10(F)
ROW1LED6: DISPLAY4.5(G) DISPLAY5.5(G) DISPLAY6.5(G)
ROW1LED7: DISPLAY4.3(DP) DISPLAY5.3(DP) DISPLAY6.3(DP)
ROW2LED0: DISPLAY7.11(A) DISPLAY8.11(A) DISPLAY9.11(A)
ROW2LED1: DISPLAY7.7(B) DISPLAY8.7(B) DISPLAY9.7(B)
ROW2LED2: DISPLAY7.4(C) DISPLAY8.4(C) DISPLAY9.4(C)
ROW2LED3: DISPLAY7.2(D) DISPLAY8.2(D) DISPLAY9.2(D)
ROW2LED4: DISPLAY7.1(E) DISPLAY8.1(E) DISPLAY9.1(E)
ROW2LED5: DISPLAY7.10(F) DISPLAY8.10(F) DISPLAY9.10(F)
ROW2LED6: DISPLAY7.5(G) DISPLAY8.5(G) DISPLAY9.5(G)
ROW2LED7: DISPLAY7.3(DP) DISPLAY8.3(DP) DISPLAY9.3(DP)
ROW3LED0: DISPLAY10.11(A) DISPLAY11.11(A) DISPLAY12.11(A)
ROW3LED1: DISPLAY10.7(B) DISPLAY11.7(B) DISPLAY12.7(B)
ROW3LED2: DISPLAY10.4(C) DISPLAY11.4(C) DISPLAY12.4(C)
ROW3LED3: DISPLAY10.2(D) DISPLAY11.2(D) DISPLAY12.2(D)
ROW3LED4: DISPLAY10.1(E) DISPLAY11.1(E) DISPLAY12.1(E)
ROW3LED5: DISPLAY10.10(F) DISPLAY11.10(F) DISPLAY12.10(F)
ROW3LED6: DISPLAY10.5(G) DISPLAY11.5(G) DISPLAY12.5(G)
ROW3LED7: DISPLAY10.3(DP) DISPLAY11.3(DP) DISPLAY12.3(DP)
ROW4LED0: DISPLAY13.11(A) DISPLAY14.11(A) DISPLAY15.11(A)
ROW4LED1: DISPLAY13.7(B) DISPLAY14.7(B) DISPLAY15.7(B)
ROW4LED2: DISPLAY13.4(C) DISPLAY14.4(C) DISPLAY15.4(C)
ROW4LED3: DISPLAY13.2(D) DISPLAY14.2(D) DISPLAY15.2(D)
ROW4LED4: DISPLAY13.1(E) DISPLAY14.1(E) DISPLAY15.1(E)
ROW4LED5: DISPLAY13.10(F) DISPLAY14.10(F) DISPLAY15.10(F)
ROW4LED6: DISPLAY13.5(G) DISPLAY14.5(G) DISPLAY15.5(G)
ROW4LED7: DISPLAY13.3(DP) DISPLAY14.3(DP) DISPLAY15.3(DP)
ROW5LED0: DISPLAY16.11(A) DISPLAY17.11(A) DISPLAY18.11(A)
ROW5LED1: DISPLAY16.7(B) DISPLAY17.7(B) DISPLAY18.7(B)
ROW5LED2: DISPLAY16.4(C) DISPLAY17.4(C) DISPLAY18.4(C)
ROW5LED3: DISPLAY16.2(D) DISPLAY17.2(D) DISPLAY18.2(D)
ROW5LED4: DISPLAY16.1(E) DISPLAY17.1(E) DISPLAY18.1(E)
ROW5LED5: DISPLAY16.10(F) DISPLAY17.10(F) DISPLAY18.10(F)
ROW5LED6: DISPLAY16.5(G) DISPLAY17.5(G) DISPLAY18.5(G)
ROW5LED7: DISPLAY16.3(DP) DISPLAY17.3(DP) DISPLAY18.3(DP)
ROW6LED0: DISPLAY19.11(A) DISPLAY20.11(A) DISPLAY21.11(A)
ROW6LED1: DISPLAY19.7(B) DISPLAY20.7(B) DISPLAY21.7(B)
ROW6LED2: DISPLAY19.4(C) DISPLAY20.4(C) DISPLAY21.4(C)
ROW6LED3: DISPLAY19.2(D) DISPLAY20.2(D) DISPLAY21.2(D)
ROW6LED4: DISPLAY19.1(E) DISPLAY20.1(E) DISPLAY21.1(E)
ROW6LED5: DISPLAY19.10(F) DISPLAY20.10(F) DISPLAY21.10(F)
ROW6LED6: DISPLAY19.5(G) DISPLAY20.5(G) DISPLAY21.5(G)
ROW6LED7: DISPLAY19.3(DP) DISPLAY20.3(DP) DISPLAY21.3(DP)
ROW7LED0: DISPLAY22.11(A) DISPLAY23.11(A) DISPLAY24.11(A)
ROW7LED1: DISPLAY22.7(B) DISPLAY23.7(B) DISPLAY24.7(B)
ROW7LED2: DISPLAY22.4(C) DISPLAY23.4(C) DISPLAY24.4(C)
ROW7LED3: DISPLAY22.2(D) DISPLAY23.2(D) DISPLAY24.2(D)
ROW7LED4: DISPLAY22.1(E) DISPLAY23.1(E) DISPLAY24.1(E)
ROW7LED5: DISPLAY22.10(F) DISPLAY23.10(F) DISPLAY24.10(F)
ROW7LED6: DISPLAY22.5(G) DISPLAY23.5(G) DISPLAY24.5(G)
ROW7LED7: DISPLAY22.3(DP) DISPLAY23.3(DP) DISPLAY24.3(DP)
ROW8LED0: DISPLAY25.11(A) DISPLAY26.11(A) DISPLAY27.11(A)
ROW8LED1: DISPLAY25.7(B) DISPLAY26.7(B) DISPLAY27.7(B)
ROW8LED2: DISPLAY25.4(C) DISPLAY26.4(C) DISPLAY27.4(C)
ROW8LED3: DISPLAY25.2(D) DISPLAY26.2(D) DISPLAY27.2(D)
ROW8LED4: DISPLAY25.1(E) DISPLAY26.1(E) DISPLAY27.1(E)
ROW8LED5: DISPLAY25.10(F) DISPLAY26.10(F) DISPLAY27.10(F)
ROW8LED6: DISPLAY25.5(G) DISPLAY26.5(G) DISPLAY27.5(G)
ROW8LED7: DISPLAY25.3(DP) DISPLAY26.3(DP) DISPLAY27.3(DP)

### Buses and harness runs
bus /LEDCOL[8..0]
bus ROW0LED[7..0]
bus ROW1LED[7..0]
bus ROW2LED[7..0]
bus ROW3LED[7..0]
bus ROW4LED[7..0]
bus ROW5LED[7..0]
bus ROW6LED[7..0]
bus ROW7LED[7..0]
bus ROW8LED[7..0]

### Library data of the parts
DISPLAY1 = 3DIGITREDCC: 7-Segment Display; MinimumIntensity: 360 ucd; Note: Pins 1 and 6 are redundant Cathodes.; Published: 8-Jun-2000; LatestRevisionDate: 17-Dec-2003; LatestRevisionNote: Schematic revised, PCB Footprint replaced.; DatasheetVersion: 19-Feb-2002; PackageVersion: 11-Feb-2002; PackageReference: A; Publisher: Altium Limited; PackageDescription: LED, 7-Segment Display, 7.62 mm, RHD; 10 Leads; Row Space 5.08 mm; Pitch 2.54 mm; Colour: High Efficiency Red (HER); ComponentLink1Description: Manufacturer Link; ComponentLink1URL: http://www.agilent.com/
DISPLAY2-DISPLAY27 = 3DIGITREDCC: 7.62 mm Black Surface HER 7-Segment Display: CC, RH DP; MinimumIntensity: 360 ucd; Note: Pins 1 and 6 are redundant Cathodes.; Published: 8-Jun-2000; LatestRevisionDate: 17-Dec-2003; LatestRevisionNote: Schematic revised, PCB Footprint replaced.; DatasheetVersion: 19-Feb-2002; PackageVersion: 11-Feb-2002; PackageReference: A; Publisher: Altium Limited; PackageDescription: LED, 7-Segment Display, 7.62 mm, RHD; 10 Leads; Row Space 5.08 mm; Pitch 2.54 mm; Colour: High Efficiency Red (HER); ComponentLink1Description: Manufacturer Link; ComponentLink1URL: http://www.agilent.com/

## Nets that join several sheets
GND: miscellaneous (17 pins), connectors (19 pins), keyboard (56 pins)
/LEDCOL0: miscellaneous (U1.16), display (9 pins)
/LEDCOL1: miscellaneous (U1.15), display (9 pins)
/LEDCOL2: miscellaneous (U1.14), display (9 pins)
/LEDCOL3: miscellaneous (U1.13), display (9 pins)
/LEDCOL4: miscellaneous (U1.12), display (9 pins)
/LEDCOL5: miscellaneous (U1.11), display (9 pins)
/LEDCOL6: miscellaneous (U1.10), display (9 pins)
/LEDCOL7: miscellaneous (U2.16), display (9 pins)
/LEDCOL8: miscellaneous (U2.15), display (9 pins)
CHECKANS: miscellaneous (S30.1 S30.2), connectors (J1.38)
COLON: connectors (J1.23), keyboard (9 pins)
CORRECT: miscellaneous (D59.1), connectors (J1.32)
DIFFEASY: miscellaneous (D56.1), connectors (J1.39)
DIFFHARD: miscellaneous (D58.1), connectors (J1.35)
DIFFMED: miscellaneous (D57.1), connectors (J1.37)
DIFFSET: miscellaneous (S33.1 S33.2), connectors (J1.33)
DIGON: connectors (J1.9), keyboard (10 pins)
GIVEUP: miscellaneous (S32.1 S32.2), connectors (J1.31)
KEY0: connectors (J1.27), keyboard (D4.1 D5.1 D6.1)
KEY1: connectors (J1.25), keyboard (D10.1 D11.1 D12.1)
KEY2: connectors (J1.21), keyboard (D16.1 D17.1 D18.1)
KEY3: connectors (J1.19), keyboard (D22.1 D23.1 D24.1)
KEY4: connectors (J1.17), keyboard (D28.1 D29.1 D30.1)
KEY5: connectors (J1.13), keyboard (D34.1 D35.1 D36.1)
KEY6: connectors (J1.11), keyboard (D40.1 D41.1 D42.1)
KEY7: connectors (J1.5), keyboard (D46.1 D47.1 D48.1)
KEY8: connectors (J1.3), keyboard (D52.1 D53.1 D54.1)
KEY9: connectors (J1.1), keyboard (D55.2 S28.1 S28.2)
LEDCOL0: miscellaneous (U1.6), connectors (J1.2)
LEDCOL1: miscellaneous (U1.5), connectors (J1.4)
LEDCOL2: miscellaneous (U1.4), connectors (J1.6)
LEDCOL3: miscellaneous (U1.3), connectors (J1.8)
LEDCOL4: miscellaneous (U1.2), connectors (J1.10)
LEDCOL5: miscellaneous (U1.1), connectors (J1.12)
LEDCOL6: miscellaneous (U1.7), connectors (J1.14)
LEDCOL7: miscellaneous (U2.1), connectors (J1.16)
LEDCOL8: miscellaneous (U2.2), connectors (J1.18)
NEWGAME: miscellaneous (S29.1 S29.2), connectors (J1.36)
ROW0LED0: connectors (R46.1), display (DISPLAY1.11 DISPLAY2.11 DISPLAY3.11)
ROW0LED1: connectors (R48.1), display (DISPLAY1.7 DISPLAY2.7 DISPLAY3.7)
ROW0LED2: connectors (R50.1), display (DISPLAY1.4 DISPLAY2.4 DISPLAY3.4)
ROW0LED3: connectors (R52.1), display (DISPLAY1.2 DISPLAY2.2 DISPLAY3.2)
ROW0LED4: connectors (R53.1), display (DISPLAY1.1 DISPLAY2.1 DISPLAY3.1)
ROW0LED5: connectors (R55.1), display (DISPLAY1.10 DISPLAY2.10 DISPLAY3.10)
ROW0LED6: connectors (R57.1), display (DISPLAY1.5 DISPLAY2.5 DISPLAY3.5)
ROW0LED7: connectors (R59.1), display (DISPLAY1.3 DISPLAY2.3 DISPLAY3.3)
ROW1LED0: connectors (R30.1), display (DISPLAY4.11 DISPLAY5.11 DISPLAY6.11)
ROW1LED1: connectors (R32.1), display (DISPLAY4.7 DISPLAY5.7 DISPLAY6.7)
ROW1LED2: connectors (R34.1), display (DISPLAY4.4 DISPLAY5.4 DISPLAY6.4)
ROW1LED3: connectors (R36.1), display (DISPLAY4.2 DISPLAY5.2 DISPLAY6.2)
ROW1LED4: connectors (R37.1), display (DISPLAY4.1 DISPLAY5.1 DISPLAY6.1)
ROW1LED5: connectors (R39.1), display (DISPLAY4.10 DISPLAY5.10 DISPLAY6.10)
ROW1LED6: connectors (R41.1), display (DISPLAY4.5 DISPLAY5.5 DISPLAY6.5)
ROW1LED7: connectors (R43.1), display (DISPLAY4.3 DISPLAY5.3 DISPLAY6.3)
ROW2LED0: connectors (R62.2), display (DISPLAY7.11 DISPLAY8.11 DISPLAY9.11)
ROW2LED1: connectors (R64.2), display (DISPLAY7.7 DISPLAY8.7 DISPLAY9.7)
ROW2LED2: connectors (R66.2), display (DISPLAY7.4 DISPLAY8.4 DISPLAY9.4)
ROW2LED3: connectors (R68.2), display (DISPLAY7.2 DISPLAY8.2 DISPLAY9.2)
ROW2LED4: connectors (R69.2), display (DISPLAY7.1 DISPLAY8.1 DISPLAY9.1)
ROW2LED5: connectors (R70.2), display (DISPLAY7.10 DISPLAY8.10 DISPLAY9.10)
ROW2LED6: connectors (R71.2), display (DISPLAY7.5 DISPLAY8.5 DISPLAY9.5)
ROW2LED7: connectors (R72.2), display (DISPLAY7.3 DISPLAY8.3 DISPLAY9.3)
ROW3LED0: connectors (R25.2), display (DISPLAY10.11 DISPLAY11.11 DISPLAY12.11)
ROW3LED1: connectors (R26.2), display (DISPLAY10.7 DISPLAY11.7 DISPLAY12.7)
ROW3LED2: connectors (R27.2), display (DISPLAY10.4 DISPLAY11.4 DISPLAY12.4)
ROW3LED3: connectors (R28.2), display (DISPLAY10.2 DISPLAY11.2 DISPLAY12.2)
ROW3LED4: connectors (R29.2), display (DISPLAY10.1 DISPLAY11.1 DISPLAY12.1)
ROW3LED5: connectors (R31.2), display (DISPLAY10.10 DISPLAY11.10 DISPLAY12.10)
ROW3LED6: connectors (R33.2), display (DISPLAY10.5 DISPLAY11.5 DISPLAY12.5)
ROW3LED7: connectors (R35.2), display (DISPLAY10.3 DISPLAY11.3 DISPLAY12.3)
ROW4LED0: connectors (R38.2), display (DISPLAY13.11 DISPLAY14.11 DISPLAY15.11)
ROW4LED1: connectors (R40.2), display (DISPLAY13.7 DISPLAY14.7 DISPLAY15.7)
ROW4LED2: connectors (R42.2), display (DISPLAY13.4 DISPLAY14.4 DISPLAY15.4)
ROW4LED3: connectors (R44.2), display (DISPLAY13.2 DISPLAY14.2 DISPLAY15.2)
ROW4LED4: connectors (R45.2), display (DISPLAY13.1 DISPLAY14.1 DISPLAY15.1)
ROW4LED5: connectors (R47.2), display (DISPLAY13.10 DISPLAY14.10 DISPLAY15.10)
ROW4LED6: connectors (R49.2), display (DISPLAY13.5 DISPLAY14.5 DISPLAY15.5)
ROW4LED7: connectors (R51.2), display (DISPLAY13.3 DISPLAY14.3 DISPLAY15.3)
ROW5LED0: connectors (R54.2), display (DISPLAY16.11 DISPLAY17.11 DISPLAY18.11)
ROW5LED1: connectors (R56.2), display (DISPLAY16.7 DISPLAY17.7 DISPLAY18.7)
ROW5LED2: connectors (R58.2), display (DISPLAY16.4 DISPLAY17.4 DISPLAY18.4)
ROW5LED3: connectors (R60.2), display (DISPLAY16.2 DISPLAY17.2 DISPLAY18.2)
ROW5LED4: connectors (R61.2), display (DISPLAY16.1 DISPLAY17.1 DISPLAY18.1)
ROW5LED5: connectors (R63.2), display (DISPLAY16.10 DISPLAY17.10 DISPLAY18.10)
ROW5LED6: connectors (R65.2), display (DISPLAY16.5 DISPLAY17.5 DISPLAY18.5)
ROW5LED7: connectors (R67.2), display (DISPLAY16.3 DISPLAY17.3 DISPLAY18.3)
ROW6LED0: connectors (R4.1), display (DISPLAY19.11 DISPLAY20.11 DISPLAY21.11)
ROW6LED1: connectors (R6.1), display (DISPLAY19.7 DISPLAY20.7 DISPLAY21.7)
ROW6LED2: connectors (R8.1), display (DISPLAY19.4 DISPLAY20.4 DISPLAY21.4)
ROW6LED3: connectors (R10.1), display (DISPLAY19.2 DISPLAY20.2 DISPLAY21.2)
ROW6LED4: connectors (R12.1), display (DISPLAY19.1 DISPLAY20.1 DISPLAY21.1)
ROW6LED5: connectors (R14.1), display (DISPLAY19.10 DISPLAY20.10 DISPLAY21.10)
ROW6LED6: connectors (R15.1), display (DISPLAY19.5 DISPLAY20.5 DISPLAY21.5)
ROW6LED7: connectors (R17.1), display (DISPLAY19.3 DISPLAY20.3 DISPLAY21.3)
ROW7LED0: connectors (R1.1), display (DISPLAY22.11 DISPLAY23.11 DISPLAY24.11)
ROW7LED1: connectors (R2.1), display (DISPLAY22.7 DISPLAY23.7 DISPLAY24.7)
ROW7LED2: connectors (R3.1), display (DISPLAY22.4 DISPLAY23.4 DISPLAY24.4)
ROW7LED3: connectors (R5.1), display (DISPLAY22.2 DISPLAY23.2 DISPLAY24.2)
ROW7LED4: connectors (R7.1), display (DISPLAY22.1 DISPLAY23.1 DISPLAY24.1)
ROW7LED5: connectors (R9.1), display (DISPLAY22.10 DISPLAY23.10 DISPLAY24.10)
ROW7LED6: connectors (R11.1), display (DISPLAY22.5 DISPLAY23.5 DISPLAY24.5)
ROW7LED7: connectors (R13.1), display (DISPLAY22.3 DISPLAY23.3 DISPLAY24.3)
ROW8LED0: connectors (R16.1), display (DISPLAY25.11 DISPLAY26.11 DISPLAY27.11)
ROW8LED1: connectors (R18.1), display (DISPLAY25.7 DISPLAY26.7 DISPLAY27.7)
ROW8LED2: connectors (R19.1), display (DISPLAY25.4 DISPLAY26.4 DISPLAY27.4)
ROW8LED3: connectors (R20.1), display (DISPLAY25.2 DISPLAY26.2 DISPLAY27.2)
ROW8LED4: connectors (R21.1), display (DISPLAY25.1 DISPLAY26.1 DISPLAY27.1)
ROW8LED5: connectors (R22.1), display (DISPLAY25.10 DISPLAY26.10 DISPLAY27.10)
ROW8LED6: connectors (R23.1), display (DISPLAY25.5 DISPLAY26.5 DISPLAY27.5)
ROW8LED7: connectors (R24.1), display (DISPLAY25.3 DISPLAY26.3 DISPLAY27.3)
ROWON: connectors (J1.7), keyboard (9 pins)
RSTGAME: miscellaneous (S31.1 S31.2), connectors (J1.40)
WRONG: miscellaneous (D60.1), connectors (J1.34)